# Altium schematic sheet HSDACircuit.SchDoc
size A4; SheetNumber: 5; SheetTotal: 6
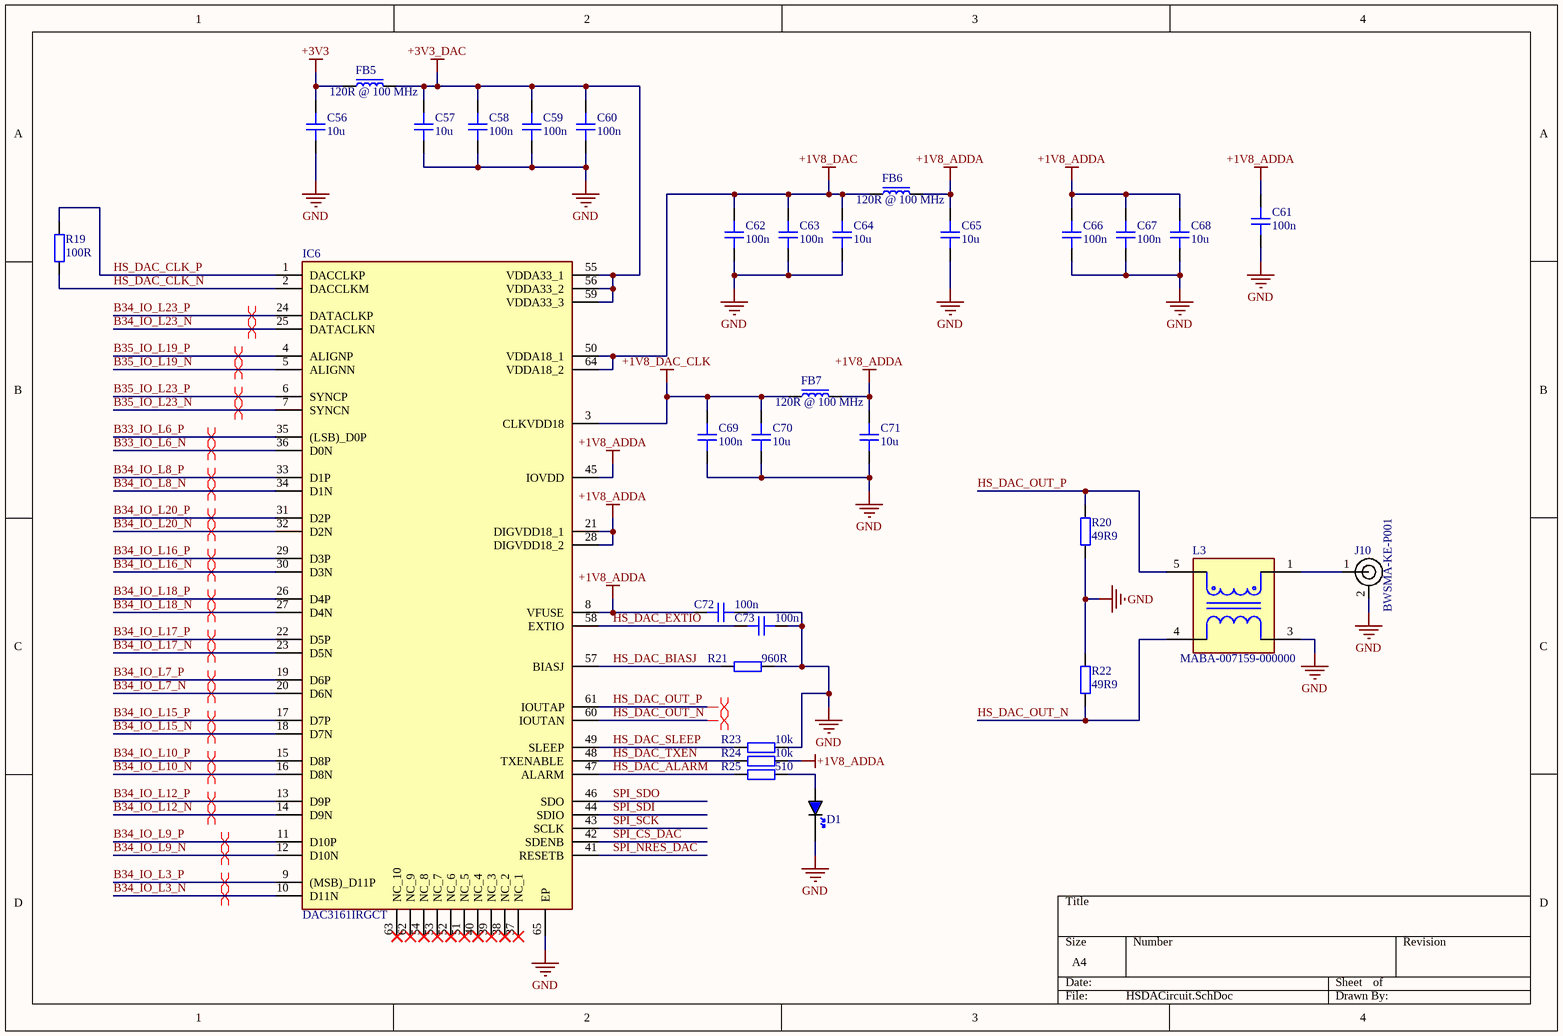
[diagram p0: HSDACircuit.SchDoc]

## Parts
C56  10u  [CAP_0603]
C57  10u  [CAP_0603]
C58  100n  [CAP_0402]
C59  100n  [CAP_0402]
C60  100n  [CAP_0402]
C61  100n  [CAP_0402]
C62  100n  [CAP_0402]
C63  100n  [CAP_0402]
C64  10u  [CAP_0603]
C65  10u  [CAP_0603]
C66  100n  [CAP_0402]
C67  100n  [CAP_0402]
C68  10u  [CAP_0603]
C69  100n  [CAP_0402]
C70  10u  [CAP_0603]
C71  10u  [CAP_0603]
C72  100n  [CAP_0402]
C73  100n  [CAP_0402]
D1  BLUE  [LED_0603_BLUE]  (value not drawn)
FB5  120R @ 100 MHz  [FB_0603]
FB6  120R @ 100 MHz  [FB_0603]
FB7  120R @ 100 MHz  [FB_0603]
IC6  DAC3161IRGCT  [QFN50P900X900X100-65N-D]
J10  BWSMA-KE-P001  [BWSMA-KE-P001]
L3  MABA-007159-000000  [FP-MABA-007159-000000-MFG]
R19  100R  [RES_0402]
R20  49R9  [RES_0402]
R21  960R  [RES_0402]
R22  49R9  [RES_0402]
R23  10k  [RES_0402]
R24  10k  [RES_0402]
R25  510  [RES_0603]

## Nets
+1V8_ADDA: C61.1 C65.2 C66.1 C67.1 C68.2 C71.2 C72.1 FB6.2 FB7.2 IC6.8(VFUSE) IC6.21(DIGVDD18_1) IC6.28(DIGVDD18_2) IC6.45(IOVDD) R24.1
+1V8_DAC: C62.1 C63.1 C64.2 FB6.1 IC6.50(VDDA18_1) IC6.64(VDDA18_2)
+1V8_DAC_CLK: C69.1 C70.2 FB7.1 IC6.3(CLKVDD18)
+3V3: C56.2 FB5.2
+3V3_DAC: C57.2 C58.1 C59.1 C60.1 FB5.1 IC6.55(VDDA33_1) IC6.56(VDDA33_2) IC6.59(VDDA33_3)
GND: C56.1 C57.1 C58.2 C59.2 C60.2 C61.2 C62.2 C63.2 C64.1 C65.1 C66.2 C67.2 C68.1 C69.2 C70.1 C71.1 C72.2 C73.2 D1.K IC6.65(EP) J10.2 L3.3(Secondary) R20.2 R21.1 R22.1 R23.1
B33_IO_L6_N: IC6.36(D0N)
B33_IO_L6_P: IC6.35((LSB)_D0P)
B34_IO_L3_N: IC6.10(D11N)
B34_IO_L3_P: IC6.9((MSB)_D11P)
B34_IO_L7_N: IC6.20(D6N)
B34_IO_L7_P: IC6.19(D6P)
B34_IO_L8_N: IC6.34(D1N)
B34_IO_L8_P: IC6.33(D1P)
B34_IO_L9_N: IC6.12(D10N)
B34_IO_L9_P: IC6.11(D10P)
B34_IO_L10_N: IC6.16(D8N)
B34_IO_L10_P: IC6.15(D8P)
B34_IO_L12_N: IC6.14(D9N)
B34_IO_L12_P: IC6.13(D9P)
B34_IO_L15_N: IC6.18(D7N)
B34_IO_L15_P: IC6.17(D7P)
B34_IO_L16_N: IC6.30(D3N)
B34_IO_L16_P: IC6.29(D3P)
B34_IO_L17_N: IC6.23(D5N)
B34_IO_L17_P: IC6.22(D5P)
B34_IO_L18_N: IC6.27(D4N)
B34_IO_L18_P: IC6.26(D4P)
B34_IO_L20_N: IC6.32(D2N)
B34_IO_L20_P: IC6.31(D2P)
B34_IO_L23_N: IC6.25(DATACLKN)
B34_IO_L23_P: IC6.24(DATACLKP)
B35_IO_L19_N: IC6.5(ALIGNN)
B35_IO_L19_P: IC6.4(ALIGNP)
B35_IO_L23_N: IC6.7(SYNCN)
B35_IO_L23_P: IC6.6(SYNCP)
HS_DAC_ALARM: IC6.47(ALARM) R25.1
HS_DAC_BIASJ: IC6.57(BIASJ) R21.2
HS_DAC_CLK_N: IC6.2(DACCLKM) R19.1
HS_DAC_CLK_P: IC6.1(DACCLKP) R19.2
HS_DAC_EXTIO: C73.1 IC6.58(EXTIO)
HS_DAC_OUT_N: IC6.60(IOUTAN) L3.4(Primary) R22.2
HS_DAC_OUT_P: IC6.61(IOUTAP) L3.5(Primary_Dot) R20.1
HS_DAC_SLEEP: IC6.49(SLEEP) R23.2
HS_DAC_TXEN: IC6.48(TXENABLE) R24.2
SPI_CS_DAC: IC6.42(SDENB)
SPI_NRES_DAC: IC6.41(RESETB)
SPI_SCK: IC6.43(SCLK)
SPI_SDI: IC6.44(SDIO)
SPI_SDO: IC6.46(SDO)
NetD1_A: D1.A R25.2
NetJ10_1: J10.1 L3.1(Secondary_Dot)

Not connected (* = marked no-connect by the designer): IC6 37(NC_1)* 38(NC_2)* 39(NC_3)* 40(NC_4)* 51(NC_5)* 52(NC_6)* 53(NC_7)* 54(NC_8)* 62(NC_9)* 63(NC_10)*

## Layout directives
differential pair: B33_IO_L6_N, B33_IO_L6_P, B34_IO_L3_N, B34_IO_L3_P, B34_IO_L7_N, B34_IO_L7_P, B34_IO_L8_N, B34_IO_L8_P, B34_IO_L9_N, B34_IO_L9_P, B34_IO_L10_N, B34_IO_L10_P, B34_IO_L12_N, B34_IO_L12_P, B34_IO_L15_N, B34_IO_L15_P, B34_IO_L16_N, B34_IO_L16_P, B34_IO_L17_N, B34_IO_L17_P, B34_IO_L18_N, B34_IO_L18_P, B34_IO_L20_N, B34_IO_L20_P, B34_IO_L23_N, B34_IO_L23_P, B35_IO_L19_N, B35_IO_L19_P, B35_IO_L23_N, B35_IO_L23_P, HS_DAC_OUT_N, HS_DAC_OUT_P

## Library data of the parts
C56 C57 C64 C65 C68 C70 C71 = CAP_0603: Capacitor SMD 0603; Manufacturer: *; Manufacturer Part Number: *; Distributor Link: *; LCSC: *; Rating: *; Dielectric: *
C58-C63 C66 C67 C69 C72 C73 = CAP_0402: Capacitor SMD 0402; Manufacturer: *; Manufacturer Part Number: *; Distributor Link: *; LCSC: *; Rating: *; Dielectric: *
D1 = LED_0603_BLUE: LED 0603 BLUE SMD
FB5-FB7 = FB_0603: Ferrite Bead SMD 0603; Manufacturer: *; Manufacturer Part Number: *; Distributor Link: *; LCSC: *
IC6 = DAC3161IRGCT: Integrated Circuit; Manufacturer_Name: Texas Instruments; Datasheet Link: http://www.ti.com/lit/gpn/dac3161; Height: 1mm; Manufacturer_Part_Number: DAC3161IRGCT; Mouser Part Number: 595-DAC3161IRGCT; Mouser Price/Stock: https://www.mouser.com/Search/Refine.aspx?Keyword=595-DAC3161IRGCT
L3 = MABA-007159-000000: BALUN 4.5MHZ-3GHZ 1:1 6SMD FLAT; Power Rating: 250mW; Max DC Current: 30mA; Lead/Base Style: Gull Wing; Depth: 3.81mm; Lead Free: Lead Free; Turns Ratio: 1:1; Case/Package: SMD/SMT; Min Operating Temperature: -40°C; Length: 3.81mm; Width: 3.81mm; Mount: Surface Mount; Radiation Hardening: No; Number of Pins: 5; RoHS Compliant: Yes; Max Operating Temperature: 85°C; Termination: SMD/SMT; Height: 2.67mm; Packaging: Cut Tape; Package Quantity: 2000; Series: -
R19-R24 = RES_0402: Resistor SMD 0402; Manufacturer: *; Manufacturer Part Number: *; Distributor Link: *; LCSC: *
R25 = RES_0603: Resistor SMD 0603; Manufacturer: *; Manufacturer Part Number: *; Distributor Link: *; LCSC: *